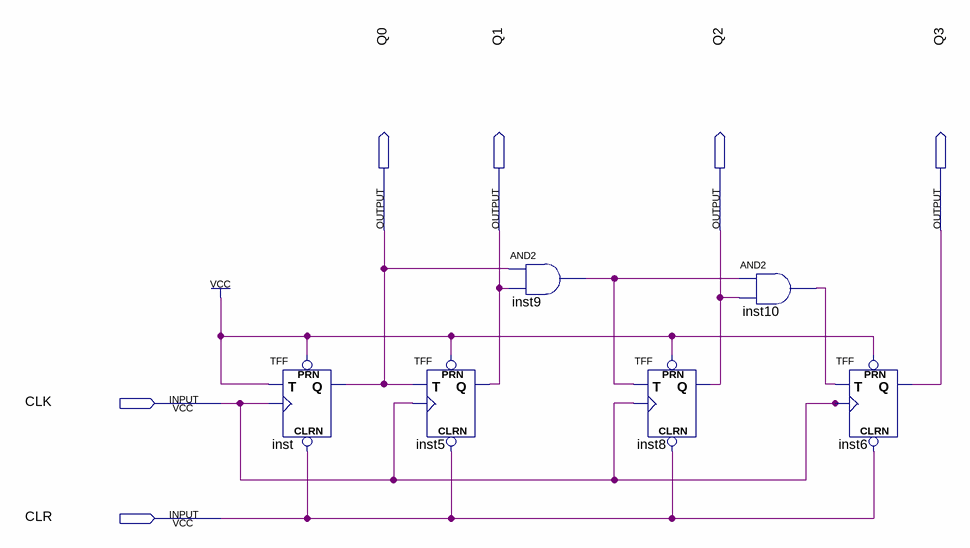
[diagram p0: schematic sheet]
// Quartus schematic schematicCounter.bdf as structural Verilog: 6 symbols, 6 pins
module schematicCounter (
  input  CLK,
  input  CLR,
  output Q0,
  output Q1,
  output Q2,
  output Q3
);

  wire inst9_out, inst10_out;

  TFF inst (.PRN(1'b1), .CLRN(CLR), .T(1'b1), .CLK(CLK), .Q(Q0));
  TFF inst5 (.PRN(1'b1), .CLRN(CLR), .T(Q0), .CLK(CLK), .Q(Q1));
  and inst9 (inst9_out, Q0, Q1);
  TFF inst8 (.PRN(1'b1), .CLRN(CLR), .T(inst9_out), .CLK(CLK), .Q(Q2));
  and inst10 (inst10_out, inst9_out, Q2);
  TFF inst6 (.PRN(1'b1), .CLRN(CLR), .T(inst10_out), .CLK(CLK), .Q(Q3));
endmodule
